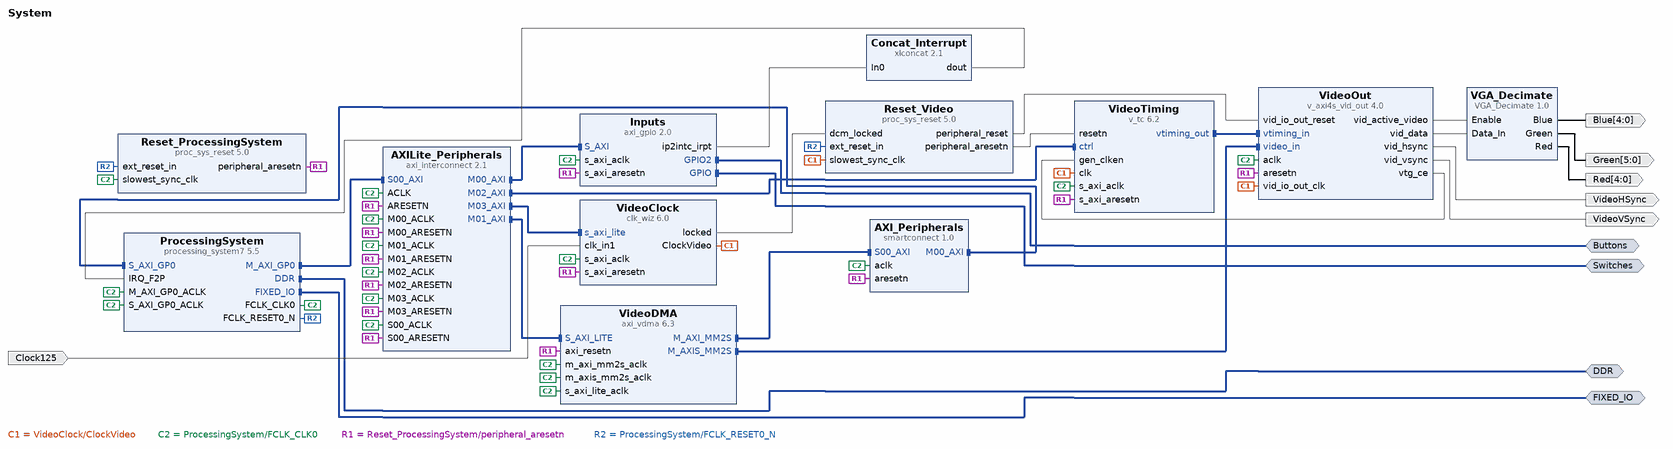
[diagram p0: block diagram of the top level]
# Vivado block design System, xc7z010clg400-1, Vivado 2023.1.1
create_bd_design System

create_bd_intf_port -mode Master -vlnv xilinx.com:interface:ddrx_rtl:1.0 DDR
create_bd_intf_port -mode Master -vlnv xilinx.com:display_processing_system7:fixedio_rtl:1.0 FIXED_IO
create_bd_intf_port -mode Master -vlnv xilinx.com:interface:gpio_rtl:1.0 Switches
create_bd_intf_port -mode Master -vlnv xilinx.com:interface:gpio_rtl:1.0 Buttons
create_bd_port -dir O VideoHSync
create_bd_port -dir O VideoVSync
create_bd_port -dir I -type clk Clock125
set_property -dict {CONFIG.FREQ_HZ 125000000} [get_bd_ports Clock125]
create_bd_port -dir O -from 4 -to 0 Red
create_bd_port -dir O -from 4 -to 0 Blue
create_bd_port -dir O -from 5 -to 0 Green

create_bd_cell -type ip -vlnv xilinx.com:ip:processing_system7:5.5 ProcessingSystem
set_property -dict [list \
  CONFIG.PCW_APU_PERIPHERAL_FREQMHZ 650.000000 \
  CONFIG.PCW_CRYSTAL_PERIPHERAL_FREQMHZ 50.000000 \
  CONFIG.PCW_ENET0_PERIPHERAL_ENABLE 0 \
  CONFIG.PCW_FCLK1_PERIPHERAL_CLKSRC {DDR PLL} \
  CONFIG.PCW_FCLK2_PERIPHERAL_CLKSRC {ARM PLL} \
  CONFIG.PCW_FPGA0_PERIPHERAL_FREQMHZ 100.000000 \
  CONFIG.PCW_FPGA1_PERIPHERAL_FREQMHZ 175.000000 \
  CONFIG.PCW_FPGA2_PERIPHERAL_FREQMHZ 12.288000 \
  CONFIG.PCW_FPGA3_PERIPHERAL_FREQMHZ 100.000000 \
  CONFIG.PCW_GPIO_MIO_GPIO_ENABLE 0 \
  CONFIG.PCW_GPIO_PERIPHERAL_ENABLE 1 \
  CONFIG.PCW_IMPORT_BOARD_PRESET /home/daniel/Projects/ZYBO/res/Zybo.xml \
  CONFIG.PCW_IRQ_F2P_INTR 1 \
  CONFIG.PCW_PERIPHERAL_BOARD_PRESET None \
  CONFIG.PCW_PRESET_BANK1_VOLTAGE {LVCMOS 1.8V} \
  CONFIG.PCW_QSPI_GRP_SINGLE_SS_ENABLE 1 \
  CONFIG.PCW_QSPI_GRP_SINGLE_SS_IO {MIO 1 .. 6} \
  CONFIG.PCW_QSPI_PERIPHERAL_ENABLE 1 \
  CONFIG.PCW_QSPI_PERIPHERAL_FREQMHZ 200.000000 \
  CONFIG.PCW_QSPI_QSPI_IO {MIO 1 .. 6} \
  CONFIG.PCW_SD0_GRP_CD_ENABLE 1 \
  CONFIG.PCW_SD0_GRP_CD_IO {MIO 47} \
  CONFIG.PCW_SD0_GRP_WP_ENABLE 1 \
  CONFIG.PCW_SD0_GRP_WP_IO EMIO \
  CONFIG.PCW_SD0_PERIPHERAL_ENABLE 1 \
  CONFIG.PCW_SD0_SD0_IO {MIO 40 .. 45} \
  CONFIG.PCW_SDIO_PERIPHERAL_FREQMHZ 50 \
  CONFIG.PCW_SINGLE_QSPI_DATA_MODE x4 \
  CONFIG.PCW_UART1_PERIPHERAL_ENABLE 1 \
  CONFIG.PCW_UART1_UART1_IO {MIO 48 .. 49} \
  CONFIG.PCW_UART_PERIPHERAL_FREQMHZ 50 \
  CONFIG.PCW_UIPARAM_DDR_FREQ_MHZ 525.000000 \
  CONFIG.PCW_UIPARAM_DDR_PARTNO {MT41K128M16 JT-125} \
  CONFIG.PCW_USB0_PERIPHERAL_ENABLE 0 \
  CONFIG.PCW_USE_FABRIC_INTERRUPT 1 \
  CONFIG.PCW_USE_S_AXI_GP0 1 \
] [get_bd_cells ProcessingSystem]
# 459 more settings of ProcessingSystem are not shown: defaults, MIO pin electricals, DDR timing, and values the tool derives
create_bd_cell -type ip -vlnv xilinx.com:ip:proc_sys_reset:5.0 Reset_Video
create_bd_cell -type ip -vlnv xilinx.com:ip:proc_sys_reset:5.0 Reset_ProcessingSystem
create_bd_cell -type ip -vlnv xilinx.com:ip:xlconcat:2.1 Concat_Interrupt
set_property -dict {CONFIG.NUM_PORTS 1 CONFIG.dout_width 1} [get_bd_cells Concat_Interrupt]
create_bd_cell -type ip -vlnv www.kampis-elektroecke.de:Kampis-Elektroecke:VGA_Decimate:1.0 VGA_Decimate
set_property -dict {CONFIG.INPUT_SIZE 24} [get_bd_cells VGA_Decimate]
create_bd_cell -type ip -vlnv xilinx.com:ip:smartconnect:1.0 AXI_Peripherals
set_property -dict {CONFIG.NUM_SI 1} [get_bd_cells AXI_Peripherals]
create_bd_cell -type ip -vlnv xilinx.com:ip:axi_interconnect:2.1 AXILite_Peripherals
set_property -dict {CONFIG.NUM_MI 4} [get_bd_cells AXILite_Peripherals]
create_bd_cell -type ip -vlnv xilinx.com:ip:axi_gpio:2.0 Inputs
set_property -dict [list \
  CONFIG.C_ALL_INPUTS 1 \
  CONFIG.C_ALL_INPUTS_2 1 \
  CONFIG.C_GPIO2_WIDTH 4 \
  CONFIG.C_GPIO_WIDTH 4 \
  CONFIG.C_INTERRUPT_PRESENT 1 \
  CONFIG.C_IS_DUAL 1 \
] [get_bd_cells Inputs]
create_bd_cell -type ip -vlnv xilinx.com:ip:axi_vdma:6.3 VideoDMA
set_property -dict [list \
  CONFIG.c_include_s2mm 0 \
  CONFIG.c_m_axi_mm2s_data_width 32 \
  CONFIG.c_m_axis_mm2s_tdata_width 24 \
  CONFIG.c_mm2s_max_burst_length 16 \
  CONFIG.c_num_fstores 3 \
] [get_bd_cells VideoDMA]
create_bd_cell -type ip -vlnv xilinx.com:ip:v_axi4s_vid_out:4.0 VideoOut
set_property -dict {CONFIG.C_HAS_ASYNC_CLK 1 CONFIG.C_NATIVE_COMPONENT_WIDTH 8} [get_bd_cells VideoOut]
create_bd_cell -type ip -vlnv xilinx.com:ip:v_tc:6.2 VideoTiming
set_property -dict {CONFIG.HAS_AXI4_LITE true CONFIG.VIDEO_MODE 720p CONFIG.enable_detection false} [get_bd_cells VideoTiming]
create_bd_cell -type ip -vlnv xilinx.com:ip:clk_wiz:6.0 VideoClock
set_property -dict [list \
  CONFIG.CLKIN1_JITTER_PS 80.0 \
  CONFIG.CLKOUT1_DRIVES BUFG \
  CONFIG.CLKOUT1_JITTER 134.667 \
  CONFIG.CLKOUT1_PHASE_ERROR 95.888 \
  CONFIG.CLKOUT1_REQUESTED_OUT_FREQ 65.000 \
  CONFIG.CLKOUT2_DRIVES BUFG \
  CONFIG.CLKOUT3_DRIVES BUFG \
  CONFIG.CLKOUT4_DRIVES BUFG \
  CONFIG.CLKOUT5_DRIVES BUFG \
  CONFIG.CLKOUT6_DRIVES BUFG \
  CONFIG.CLKOUT7_DRIVES BUFG \
  CONFIG.CLK_OUT1_PORT ClockVideo \
  CONFIG.FEEDBACK_SOURCE FDBK_AUTO \
  CONFIG.MMCM_BANDWIDTH OPTIMIZED \
  CONFIG.MMCM_CLKFBOUT_MULT_F 8.125 \
  CONFIG.MMCM_CLKIN1_PERIOD 8.000 \
  CONFIG.MMCM_CLKIN2_PERIOD 10.000 \
  CONFIG.MMCM_CLKOUT0_DIVIDE_F 15.625 \
  CONFIG.MMCM_COMPENSATION ZHOLD \
  CONFIG.MMCM_DIVCLK_DIVIDE 1 \
  CONFIG.PRIMITIVE MMCM \
  CONFIG.PRIM_IN_FREQ 125.000 \
  CONFIG.USE_DYN_RECONFIG true \
] [get_bd_cells VideoClock]

# ---- connections ----

connect_bd_intf_net [get_bd_intf_pins AXILite_Peripherals/M03_AXI] [get_bd_intf_pins VideoClock/s_axi_lite]
connect_bd_intf_net -intf_net AXI_Lite_M00_AXI [get_bd_intf_pins AXILite_Peripherals/M00_AXI] [get_bd_intf_pins Inputs/S_AXI]
connect_bd_intf_net -intf_net AXI_Lite_M02_AXI [get_bd_intf_pins AXILite_Peripherals/M02_AXI] [get_bd_intf_pins VideoTiming/ctrl]
connect_bd_intf_net [get_bd_intf_ports Buttons] [get_bd_intf_pins Inputs/GPIO2]
connect_bd_intf_net -intf_net Switches_GPIO [get_bd_intf_ports Switches] [get_bd_intf_pins Inputs/GPIO]
connect_bd_intf_net [get_bd_intf_pins VideoDMA/M_AXIS_MM2S] [get_bd_intf_pins VideoOut/video_in]
connect_bd_intf_net [get_bd_intf_pins VideoDMA/M_AXI_MM2S] [get_bd_intf_pins AXI_Peripherals/S00_AXI]
connect_bd_intf_net [get_bd_intf_pins VideoTiming/vtiming_out] [get_bd_intf_pins VideoOut/vtiming_in]
connect_bd_intf_net -intf_net axi_smc_M00_AXI [get_bd_intf_pins AXI_Peripherals/M00_AXI] [get_bd_intf_pins ProcessingSystem/S_AXI_GP0]
connect_bd_intf_net -intf_net processing_system7_0_DDR [get_bd_intf_ports DDR] [get_bd_intf_pins ProcessingSystem/DDR]
connect_bd_intf_net -intf_net processing_system7_0_FIXED_IO [get_bd_intf_ports FIXED_IO] [get_bd_intf_pins ProcessingSystem/FIXED_IO]
connect_bd_intf_net -intf_net processing_system7_0_M_AXI_GP0 [get_bd_intf_pins ProcessingSystem/M_AXI_GP0] [get_bd_intf_pins AXILite_Peripherals/S00_AXI]
connect_bd_intf_net [get_bd_intf_pins AXILite_Peripherals/M01_AXI] [get_bd_intf_pins VideoDMA/S_AXI_LITE]
connect_bd_net [get_bd_pins Concat_Interrupt/dout] [get_bd_pins ProcessingSystem/IRQ_F2P]
connect_bd_net [get_bd_pins Inputs/ip2intc_irpt] [get_bd_pins Concat_Interrupt/In0]
connect_bd_net -net MainClock_ClockVideo [get_bd_pins VideoClock/ClockVideo] \
  [get_bd_pins Reset_Video/slowest_sync_clk] [get_bd_pins VideoOut/vid_io_out_clk] [get_bd_pins VideoTiming/clk]
connect_bd_net [get_bd_pins ProcessingSystem/FCLK_CLK0] \
  [get_bd_pins ProcessingSystem/M_AXI_GP0_ACLK] [get_bd_pins ProcessingSystem/S_AXI_GP0_ACLK] \
  [get_bd_pins Reset_ProcessingSystem/slowest_sync_clk] [get_bd_pins AXI_Peripherals/aclk] \
  [get_bd_pins AXILite_Peripherals/ACLK] [get_bd_pins AXILite_Peripherals/S00_ACLK] \
  [get_bd_pins AXILite_Peripherals/M00_ACLK] [get_bd_pins AXILite_Peripherals/M01_ACLK] \
  [get_bd_pins AXILite_Peripherals/M02_ACLK] [get_bd_pins AXILite_Peripherals/M03_ACLK] [get_bd_pins Inputs/s_axi_aclk] \
  [get_bd_pins VideoDMA/s_axi_lite_aclk] [get_bd_pins VideoDMA/m_axi_mm2s_aclk] [get_bd_pins VideoDMA/m_axis_mm2s_aclk] \
  [get_bd_pins VideoOut/aclk] [get_bd_pins VideoTiming/s_axi_aclk] [get_bd_pins VideoClock/s_axi_aclk]
connect_bd_net -net ProcessorReset_peripheral_aresetn [get_bd_pins Reset_ProcessingSystem/peripheral_aresetn] \
  [get_bd_pins AXI_Peripherals/aresetn] [get_bd_pins AXILite_Peripherals/ARESETN] \
  [get_bd_pins AXILite_Peripherals/S00_ARESETN] [get_bd_pins AXILite_Peripherals/M00_ARESETN] \
  [get_bd_pins AXILite_Peripherals/M01_ARESETN] [get_bd_pins AXILite_Peripherals/M02_ARESETN] \
  [get_bd_pins AXILite_Peripherals/M03_ARESETN] [get_bd_pins Inputs/s_axi_aresetn] [get_bd_pins VideoDMA/axi_resetn] \
  [get_bd_pins VideoOut/aresetn] [get_bd_pins VideoTiming/s_axi_aresetn] [get_bd_pins VideoClock/s_axi_aresetn]
connect_bd_net [get_bd_pins VGA_Decimate/Blue] [get_bd_ports Blue]
connect_bd_net [get_bd_pins VGA_Decimate/Green] [get_bd_ports Green]
connect_bd_net [get_bd_pins VGA_Decimate/Red] [get_bd_ports Red]
connect_bd_net [get_bd_pins VideoOut/vid_active_video] [get_bd_pins VGA_Decimate/Enable]
connect_bd_net [get_bd_pins VideoOut/vid_data] [get_bd_pins VGA_Decimate/Data_In]
connect_bd_net [get_bd_pins VideoOut/vid_hsync] [get_bd_ports VideoHSync]
connect_bd_net [get_bd_pins VideoOut/vid_vsync] [get_bd_ports VideoVSync]
connect_bd_net [get_bd_pins VideoOut/vtg_ce] [get_bd_pins VideoTiming/gen_clken]
connect_bd_net -net VideoReset_peripheral_aresetn [get_bd_pins Reset_Video/peripheral_aresetn] [get_bd_pins VideoTiming/resetn]
connect_bd_net -net VideoReset_peripheral_reset [get_bd_pins Reset_Video/peripheral_reset] [get_bd_pins VideoOut/vid_io_out_reset]
connect_bd_net -net clk_in1_0_1 [get_bd_ports Clock125] [get_bd_pins VideoClock/clk_in1]
connect_bd_net -net clk_wiz_0_locked [get_bd_pins VideoClock/locked] [get_bd_pins Reset_Video/dcm_locked]
connect_bd_net -net processing_system7_0_FCLK_RESET0_N [get_bd_pins ProcessingSystem/FCLK_RESET0_N] \
  [get_bd_pins Reset_Video/ext_reset_in] [get_bd_pins Reset_ProcessingSystem/ext_reset_in]

# ---- address map ----
assign_bd_address -offset 0x41200000 -range 64K -target_address_space [get_bd_addr_spaces ProcessingSystem/Data] [get_bd_addr_segs Inputs/S_AXI/Reg]
assign_bd_address -offset 0x43000000 -range 64K -target_address_space [get_bd_addr_spaces ProcessingSystem/Data] [get_bd_addr_segs VideoDMA/S_AXI_LITE/Reg]
assign_bd_address -offset 0x43C00000 -range 64K -target_address_space [get_bd_addr_spaces ProcessingSystem/Data] [get_bd_addr_segs VideoTiming/ctrl/Reg]
assign_bd_address -offset 0x43C10000 -range 64K -target_address_space [get_bd_addr_spaces ProcessingSystem/Data] [get_bd_addr_segs VideoClock/s_axi_lite/Reg]
assign_bd_address -offset 0x00000000 -range 512M -target_address_space [get_bd_addr_spaces VideoDMA/Data_MM2S] [get_bd_addr_segs ProcessingSystem/S_AXI_GP0/GP0_DDR_LOWOCM]
assign_bd_address -offset 0x40000000 -range 1G -target_address_space [get_bd_addr_spaces VideoDMA/Data_MM2S] [get_bd_addr_segs ProcessingSystem/S_AXI_GP0/GP0_M_AXI_GP0]
assign_bd_address -offset 0xE0000000 -range 4M -target_address_space [get_bd_addr_spaces VideoDMA/Data_MM2S] [get_bd_addr_segs ProcessingSystem/S_AXI_GP0/GP0_IOP]
assign_bd_address -offset 0xFC000000 -range 16M -target_address_space [get_bd_addr_spaces VideoDMA/Data_MM2S] [get_bd_addr_segs ProcessingSystem/S_AXI_GP0/GP0_QSPI_LINEAR]

validate_bd_design
save_bd_design
